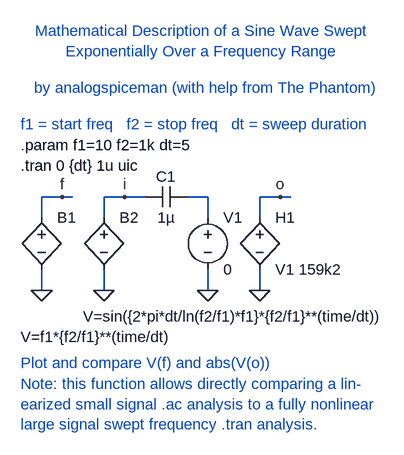
[diagram p0: schematic swept_sine_test.asc]
swept_sine_test.asc, the LTspice schematic file:
Version 4
SHEET 1 880 680
WIRE -192 80 -192 48
WIRE -192 192 -192 160
WIRE -160 48 -192 48
WIRE -144 48 -160 48
WIRE -96 80 -96 48
WIRE -96 192 -96 160
WIRE -64 48 -96 48
WIRE -32 48 -64 48
WIRE 64 48 32 48
WIRE 64 80 64 48
WIRE 64 192 64 160
WIRE 144 80 144 48
WIRE 144 192 144 160
WIRE 176 48 144 48
WIRE 192 48 176 48
FLAG -64 48 i
FLAG -160 48 f
FLAG -192 192 0
FLAG -96 192 0
FLAG 64 192 0
FLAG 176 48 o
FLAG 144 192 0
SYMBOL bv -192 64 R0
WINDOW 3 -32 200 Left 0
SYMATTR Value V=f1*{f2/f1}**(time/dt)
SYMATTR InstName B1
SYMBOL bv -96 64 R0
WINDOW 3 -32 168 Left 0
WINDOW 123 -66 214 Left 0
SYMATTR Value V=sin({2*pi*dt/ln(f2/f1)*f1}*{f2/f1}**(time/dt))
SYMATTR InstName B2
SYMBOL cap 32 32 R90
WINDOW 0 0 32 VBottom 0
WINDOW 3 32 32 VTop 0
SYMATTR InstName C1
SYMATTR Value 1µ
SYMBOL voltage 64 64 R0
SYMATTR InstName V1
SYMATTR Value 0
SYMBOL h 144 64 R0
SYMATTR InstName H1
SYMATTR Value V1 159k2
TEXT -224 0 Left 0 !.tran 0 {dt} 1u uic
TEXT -224 -32 Left 0 !.param f1=10 f2=1k dt=5
TEXT 56 -192 Center 0 ;Mathematical Description of a Sine Wave Swept\nExponentially Over a Frequency Range
TEXT -224 -64 Left 0 ;f1 = start freq   f2 = stop freq   dt = sweep duration
TEXT -224 304 Left 0 ;Plot and compare V(f) and abs(V(o))
TEXT -224 336 Left 0 ;Note: this function allows directly comparing a lin-\nearized small signal .ac analysis to a fully nonlinear\nlarge signal swept frequency .tran analysis.
TEXT 64 -120 Center 0 ;by analogspiceman (with help from The Phantom)

The netlist it stands for:
* swept_sine_test.asc
B1 f 0 V=f1*{f2/f1}**(time/dt)
B2 i 0 V=sin({2*pi*dt/ln(f2/f1)*f1}*{f2/f1}**(time/dt))
C1 N001 i 1µ
V1 N001 0 0
H1 o 0 V1 159k2
.tran 0 {dt} 1u uic
.param f1=10 f2=1k dt=5
* Mathematical Description of a Sine Wave Swept
* Exponentially Over a Frequency Range
* f1 = start freq   f2 = stop freq   dt = sweep duration
* Plot and compare V(f) and abs(V(o))
* Note: this function allows directly comparing a lin-
* earized small signal .ac analysis to a fully nonlinear
* large signal swept frequency .tran analysis.
* by analogspiceman (with help from The Phantom)
.backanno
.end